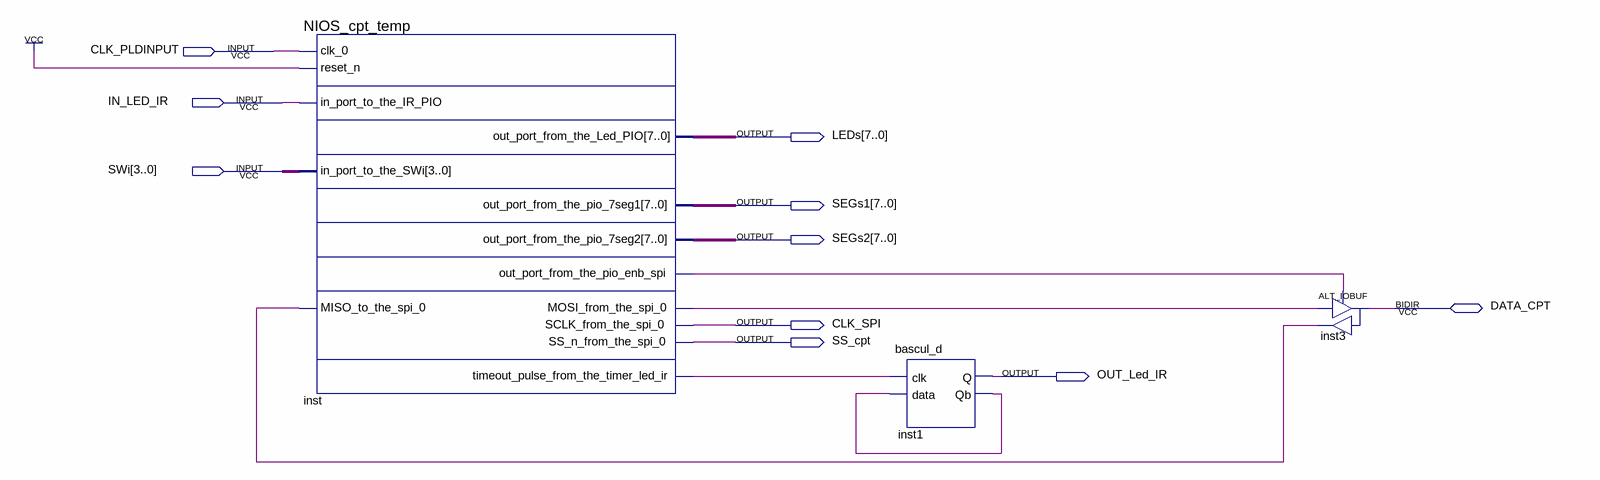
[diagram p0: schematic sheet]
// Quartus schematic cpt_temp.bdf as structural Verilog: 3 symbols, 10 pins
module cpt_temp (
  input  CLK_PLDINPUT,
  input  IN_LED_IR,
  input  [3:0] SWi,
  inout  DATA_CPT,
  output [7:0] LEDs,
  output [7:0] SEGs1,
  output [7:0] SEGs2,
  output CLK_SPI,
  output SS_cpt,
  output OUT_Led_IR
);

  wire inst1_qb, inst3_o, inst_mosi_from_the_spi_0, inst_out_port_from_the_pio_enb_spi,
       inst_timeout_pulse_from_the_timer_led_ir;

  NIOS_cpt_temp inst (
    .clk_0(CLK_PLDINPUT), .reset_n(1'b1), .in_port_to_the_IR_PIO(IN_LED_IR), .in_port_to_the_SWi(SWi),
    .MISO_to_the_spi_0(inst3_o), .out_port_from_the_Led_PIO(LEDs), .out_port_from_the_pio_7seg1(SEGs1),
    .out_port_from_the_pio_7seg2(SEGs2), .out_port_from_the_pio_enb_spi(inst_out_port_from_the_pio_enb_spi),
    .MOSI_from_the_spi_0(inst_mosi_from_the_spi_0), .SCLK_from_the_spi_0(CLK_SPI),
    .SS_n_from_the_spi_0(SS_cpt),
    .timeout_pulse_from_the_timer_led_ir(inst_timeout_pulse_from_the_timer_led_ir));
  bascul_d inst1 (.clk(inst_timeout_pulse_from_the_timer_led_ir), .data(inst1_qb), .Q(OUT_Led_IR), .Qb(inst1_qb));
  ALT_IOBUF inst3 (.i(inst_mosi_from_the_spi_0), .oe(inst_out_port_from_the_pio_enb_spi), .o(inst3_o), .io(DATA_CPT));
endmodule
